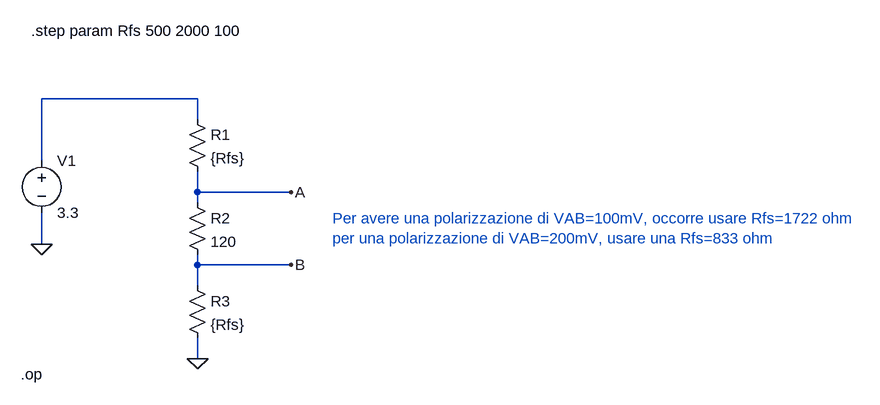
[diagram p0: schematic FailSafe_biasing_sim_Rfs.asc]
FailSafe_biasing_sim_Rfs.asc, the LTspice schematic file:
Version 4
SHEET 1 1356 680
WIRE 192 0 -48 0
WIRE 192 32 192 0
WIRE -48 96 -48 0
WIRE 192 144 192 112
WIRE 336 144 192 144
WIRE 192 160 192 144
WIRE -48 224 -48 176
WIRE 192 256 192 240
WIRE 336 256 192 256
WIRE 192 288 192 256
WIRE 192 400 192 368
FLAG 192 400 0
FLAG -48 224 0
FLAG 336 144 A
FLAG 336 256 B
SYMBOL res 176 16 R0
SYMATTR InstName R1
SYMATTR Value {Rfs}
SYMBOL res 176 144 R0
SYMATTR InstName R2
SYMATTR Value 120
SYMBOL res 176 272 R0
SYMATTR InstName R3
SYMATTR Value {Rfs}
SYMBOL voltage -48 80 R0
SYMATTR InstName V1
SYMATTR Value 3.3
TEXT -64 -104 Left 2 !.step param Rfs 500 2000 100
TEXT -80 424 Left 2 !.op
TEXT 400 184 Left 2 ;Per avere una polarizzazione di VAB=100mV, occorre usare Rfs=1722 ohm\nper una polarizzazione di VAB=200mV, usare una Rfs=833 ohm

The netlist it stands for:
* FailSafe_biasing_sim_Rfs.asc
R1 N001 A {Rfs}
R2 A B 120
R3 B 0 {Rfs}
V1 N001 0 3.3
.step param Rfs 500 2000 100
.op
* Per avere una polarizzazione di VAB=100mV, occorre usare Rfs=1722 ohm
* per una polarizzazione di VAB=200mV, usare una Rfs=833 ohm
.backanno
.end